# Altium schematic sheet optoEncoder.SchDoc
size A4
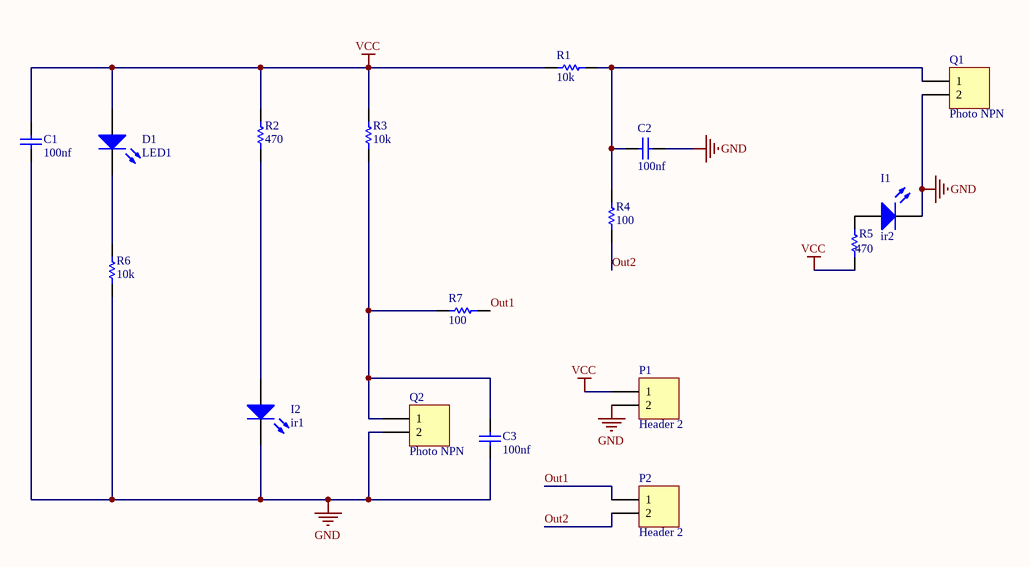
[diagram p0: optoEncoder.SchDoc]

## Parts
C1  value 100nf  [6-0805_M]  (hidden comment: Cap)
C2  value 100nf  [6-0805_M]  (hidden comment: Cap)
C3  value 100nf  [6-0805_M]  (hidden comment: Cap)
D1  LED1  [6-0805_M]
I1  ir2  [hdr1x2]
I2  ir1  [HDR1X2]
P1  Header 2  [HDR1X2]
P2  Header 2  [HDR1X2]
Q1  Photo NPN  [HDR1X2]
Q2  Photo NPN  [HDR1X2]
R1  value 10k  [6-0805_M]  (hidden comment: Res1)
R2  value 470  [6-0805_M]  (hidden comment: Res1)
R3  value 10k  [6-0805_M]  (hidden comment: Res1)
R4  value 100  [6-0805_M]  (hidden comment: Res1)
R5  value 470  [6-0805_M]  (hidden comment: Res1)
R6  value 10k  [6-0805_M]  (hidden comment: Res1)
R7  value 100  [6-0805_M]  (hidden comment: Res1)

## Nets
GND: C1.2 C2.1 C3.2 I1.2(K) I2.2(K) P1.2 Q1.2 Q2.2 R6.2
VCC: C1.1 D1.1(A) P1.1 R1.1 R2.2 R3.1 R5.1
Out1: P2.1 R7.2
Out2: P2.2 R4.1
NetC2_2: C2.2 Q1.1 R1.2 R4.2
NetC3_1: C3.1 Q2.1 R3.2 R7.1
NetD1_2: D1.2(K) R6.1
NetI1_1: I1.1(A) R5.2
NetI2_1: I2.1(A) R2.1

## Library data of the parts
C1-C3 = Cap: Capacitor; Published: 8-Jun-2000; LatestRevisionDate: 17-Jul-2002; LatestRevisionNote: Re-released for DXP Platform.; PackageReference: RAD-0.3; Publisher: Altium Limited; PackageDescription: Radial Cap, Thru-Hole; 2 Leads; 0.3 in Pin Spacing
D1 = LED2: Typical RED, GREEN, YELLOW, AMBER GaAs LED; Published: 8-Jun-2000; LatestRevisionDate: 17-Jul-2002; LatestRevisionNote: Re-released for DXP Platform.; PackageVersion: Feb-2002; PackageReference: 3.2X1.6X1.1; Publisher: Altium Limited; PackageDescription: SM LED; 2 Flat Leads
I1 I2 = LED0: Typical INFRARED GaAs LED; Published: 8-Jun-2000; LatestRevisionDate: 08-Jul-2005; LatestRevisionNote: Mech Layer 1 removed.; PackageReference: LED-0; Publisher: Altium Limited; PackageDescription: LED; 2 Leads
P1 P2 Q1 Q2 = Header 2: Header, 2-Pin; LatestRevisionDate: 17-Jul-2002; LatestRevisionNote: Re-released for DXP Platform.; Publisher: Altium Limited
R1-R7 = Res1: Resistor; Published: 8-Jun-2000; LatestRevisionDate: 17-Jul-2002; LatestRevisionNote: Re-released for DXP Platform.; PackageReference: AXIAL-0.3; Publisher: Altium Limited; PackageDescription: Axial Device, Thru-Hole; 2 Leads; 0.3 in Pin Spacing